# EAGLE schematic pm2019 (EAGLE 9.4.0)

## Sheet 1 of 2
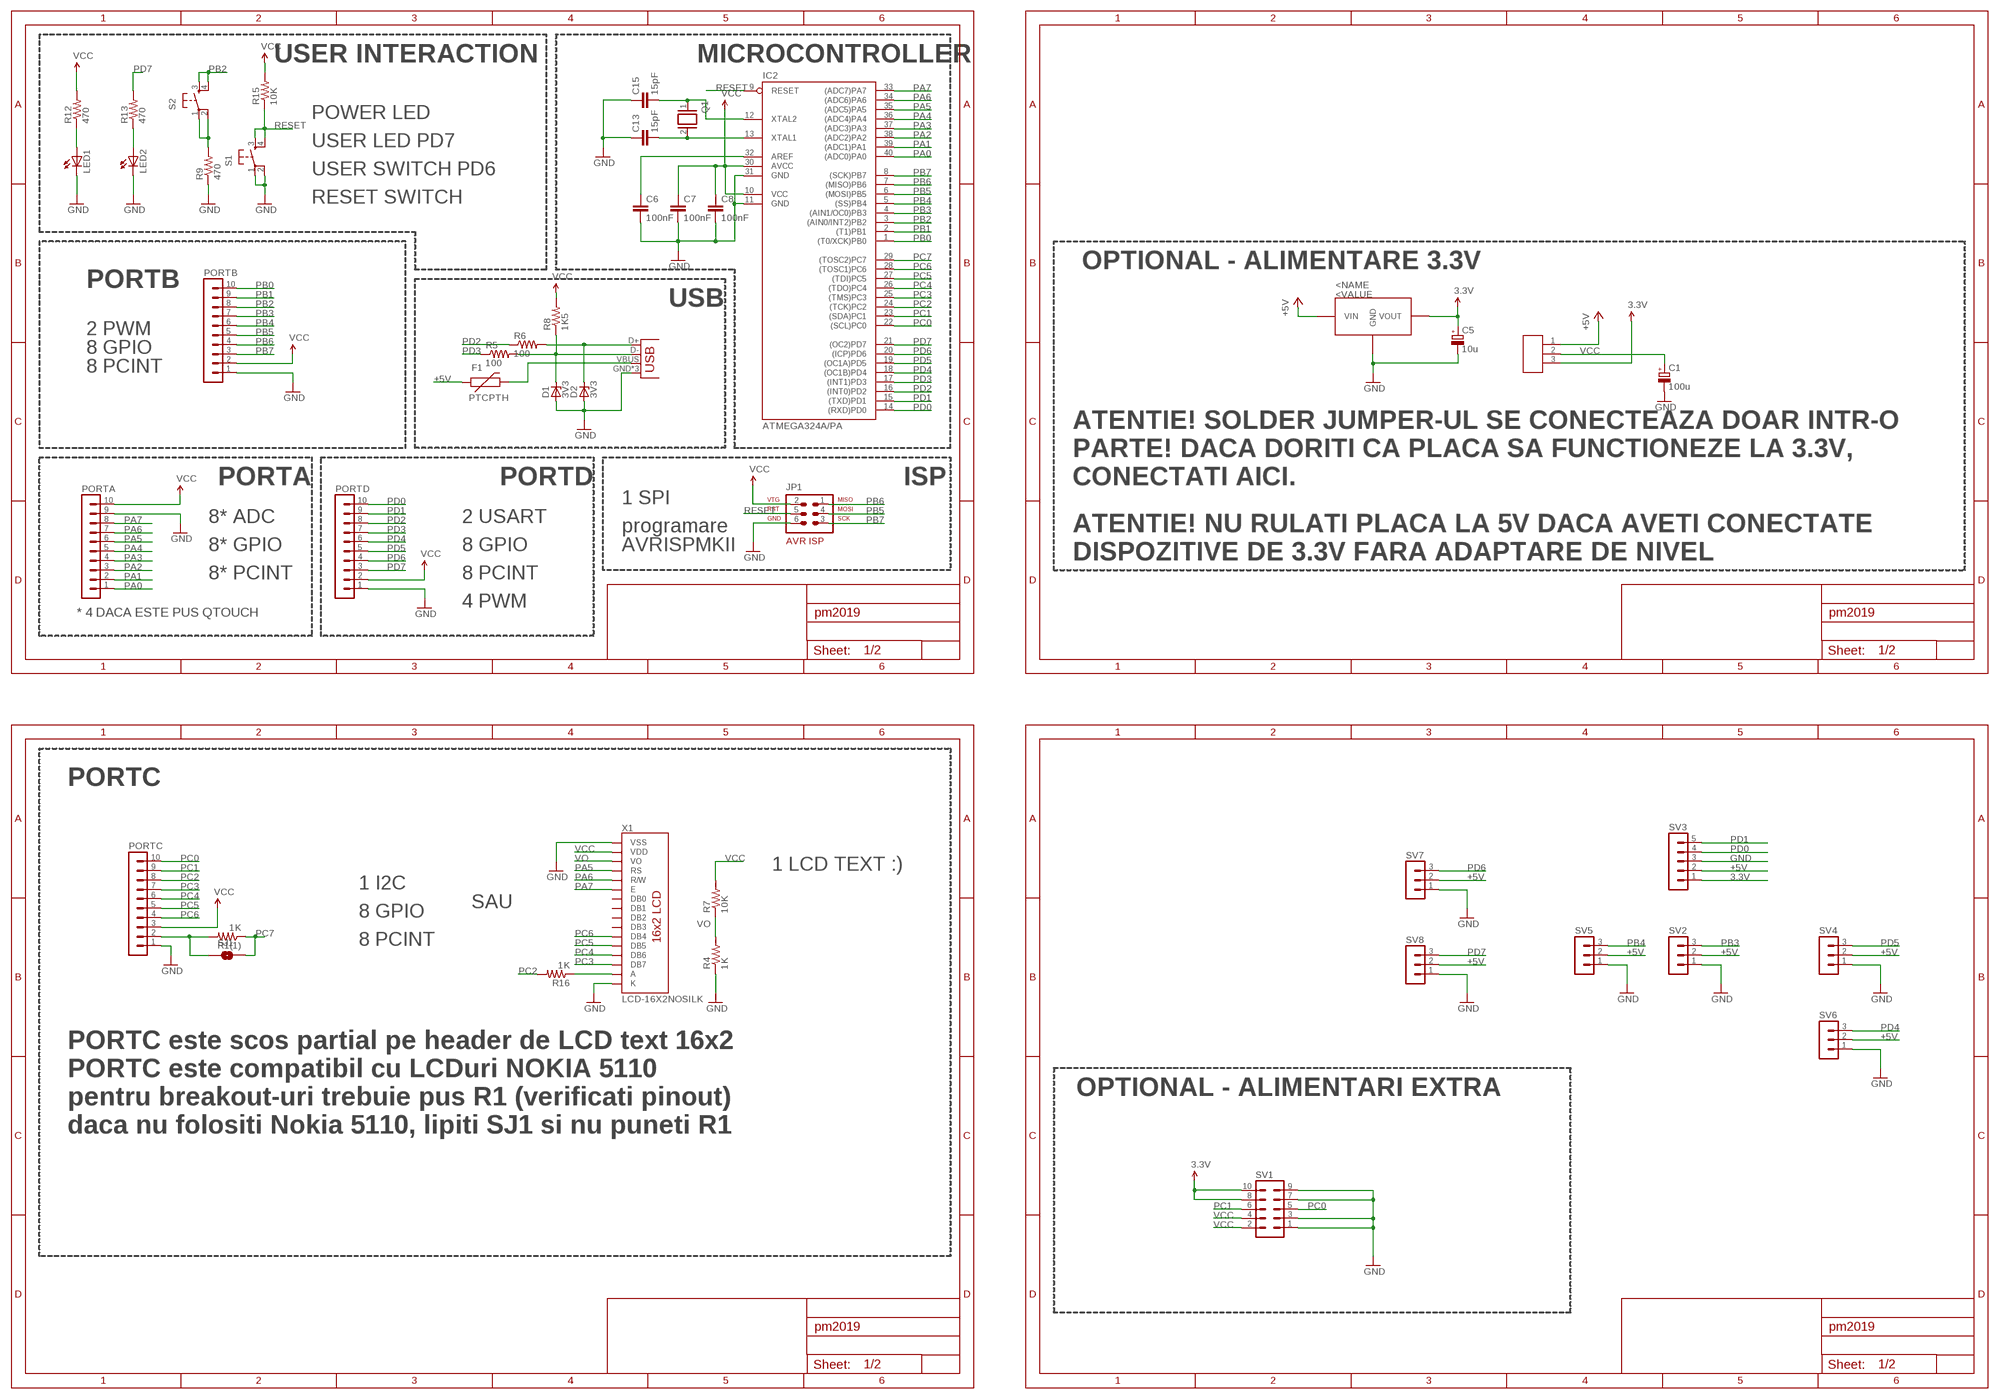
[diagram p0: schematic, sheet 1]

### Parts
C1  100u  CPOL-EUE2.5-5  [E2,5-5]
C5  10u  CPOL-EUE2.5-5  [E2,5-5]
C6  100nF  C-EUC_PM  [C025-025X050]
C7  100nF  C-EUC_PM  [C025-025X050]
C8  100nF  C-EUC_PM  [C025-025X050]
C13  15pF  C-EUC_PM  [C025-025X050]
C15  15pF  C-EUC_PM  [C025-025X050]
D1  3V3  ZENER-DIODEDO34-7  [DO34Z7]
D2  3V3  ZENER-DIODEDO34-7  [DO34Z7]
F1  PTCPTH  [PTC]
IC1  LE33  [TO92]
IC2  ATMEGA324A/PA  MEGA16-P  [DIL40]
J2  USBPTH  [USB-B-PTH]
JP1  AVR-ISP-6  [AVR-ISP-6]
JP2  SJUMPER  [SJUMPER_PACK]
LED1  LED5MM  [LED5MM]
LED2  LED5MM  [LED5MM]
PORTA  MA10-1  [MA10-1]
PORTB  MA10-1  [MA10-1]
PORTC  MA10-1  [MA10-1]
PORTD  MA10-1  [MA10-1]
Q1  XTAL/S  [QS]
R1(1)  1K  RESISTORAXIAL-0.3  [AXIAL-0.3]
R4  1K  RESISTORAXIAL-0.3  [AXIAL-0.3]
R5  100  RESISTORAXIAL-0.3  [AXIAL-0.3]
R6  100  RESISTORAXIAL-0.3  [AXIAL-0.3]
R7  10K  RESISTORAXIAL-0.3  [AXIAL-0.3]
R8  1K5  RESISTORAXIAL-0.3  [AXIAL-0.3]
R9  470  RESISTORAXIAL-0.3  [AXIAL-0.3]
R12  470  RESISTORAXIAL-0.3  [AXIAL-0.3]
R13  470  RESISTORAXIAL-0.3  [AXIAL-0.3]
R15  10K  RESISTORAXIAL-0.3  [AXIAL-0.3]
R16  1K  RESISTORAXIAL-0.3  [AXIAL-0.3]
S1  TAC_SWITCHPTH  [TACTILE-PTH]
S2  TAC_SWITCHPTH  [TACTILE-PTH]
SJ1  SOLDERJUMPERNC  [SJ-NC]
SV1  MA05-2  [MA05-2]
SV2  MA03-1  [MA03-1]
SV3  MA05-1  [MA05-1]
SV4  MA03-1  [MA03-1]
SV5  MA03-1  [MA03-1]
SV6  MA03-1  [MA03-1]
SV7  MA03-1  [MA03-1]
SV8  MA03-1  [MA03-1]
X1  LCD-16X2NOSILK  [LCD-16X2_NOSILK]

### Nets
3.3V: C5.+ IC1.1(VOUT) JP2.3 SV1.8 SV1.10 SV3.1
+5V: F1.P$1 IC1.3(VIN) JP2.1 SV2.2 SV3.2 SV4.2 SV5.2 SV6.2 SV7.2 SV8.2 ; also sheet 2
GND: C1.- C5.- C6.2 C7.2 C8.2 C13.1 C15.1 D1.A D2.A IC1.2(GND) IC2.11(GND) IC2.31(GND) J2.GND J2.P$1(GND) J2.P$2(GND) JP1.6 LED1.K(C) LED2.K(C) PORTA.9 PORTB.1 PORTC.1 PORTD.1 R4.P$1 R9.P$1 S1.1 S1.2 SV1.1 SV1.3 SV1.7 SV1.9 SV2.1 SV3.3 SV4.1 SV5.1 SV6.1 SV7.1 SV8.1 X1.1(VSS) X1.16(K) ; also sheet 2
N$1: LED2.A R13.P$1
N$2: LED1.A R12.P$1
N$3: PORTC.2 R1(1).P$2 SJ1.1
N$4: F1.P$2 J2.VBUS
N$8: R16.P$1 X1.15(A)
N$14: D2.C J2.D+ R6.P$2
N$15: D1.C J2.D- R5.P$2 R8.P$1
N$17: R9.P$2 S2.1 S2.2
N$20: C6.1 IC2.32(AREF)
N$21: C13.2 IC2.13(XTAL1) Q1.2
N$22: C15.2 IC2.12(XTAL2) Q1.1
PA0: IC2.40((ADC0)PA0) PORTA.1 ; also sheet 2
PA1: IC2.39((ADC1)PA1) PORTA.2 ; also sheet 2
PA2: IC2.38((ADC2)PA2) PORTA.3 ; also sheet 2
PA3: IC2.37((ADC3)PA3) PORTA.4 ; also sheet 2
PA4: IC2.36((ADC4)PA4) PORTA.5 ; also sheet 2
PA5: IC2.35((ADC5)PA5) PORTA.6 X1.4(RS) ; also sheet 2
PA6: IC2.34((ADC6)PA6) PORTA.7 X1.5(R/W) ; also sheet 2
PA7: IC2.33((ADC7)PA7) PORTA.8 X1.6(E) ; also sheet 2
PB0: IC2.1((T0/XCK)PB0) PORTB.10 ; also sheet 2
PB1: IC2.2((T1)PB1) PORTB.9 ; also sheet 2
PB2: IC2.3((AIN0/INT2)PB2) PORTB.8 S2.3 S2.4 ; also sheet 2
PB3: IC2.4((AIN1/OC0)PB3) PORTB.7 SV2.3 ; also sheet 2
PB4: IC2.5((SS)PB4) PORTB.6 SV5.3 ; also sheet 2
PB5: IC2.6((MOSI)PB5) JP1.4 PORTB.5 ; also sheet 2
PB6: IC2.7((MISO)PB6) JP1.1 PORTB.4 ; also sheet 2
PB7: IC2.8((SCK)PB7) JP1.3 PORTB.3 ; also sheet 2
PC0: IC2.22((SCL)PC0) PORTC.10 SV1.5 ; also sheet 2
PC1: IC2.23((SDA)PC1) PORTC.9 SV1.6 ; also sheet 2
PC2: IC2.24((TCK)PC2) PORTC.8 R16.P$2 ; also sheet 2
PC3: IC2.25((TMS)PC3) PORTC.7 X1.14(DB7) ; also sheet 2
PC4: IC2.26((TDO)PC4) PORTC.6 X1.13(DB6) ; also sheet 2
PC5: IC2.27((TDI)PC5) PORTC.5 X1.12(DB5) ; also sheet 2
PC6: IC2.28((TOSC1)PC6) PORTC.4 X1.11(DB4) ; also sheet 2
PC7: IC2.29((TOSC2)PC7) R1(1).P$1 SJ1.2 ; also sheet 2
PD0: IC2.14((RXD)PD0) PORTD.10 SV3.4 ; also sheet 2
PD1: IC2.15((TXD)PD1) PORTD.9 SV3.5 ; also sheet 2
PD2: IC2.16((INT0)PD2) PORTD.8 R6.P$1 ; also sheet 2
PD3: IC2.17((INT1)PD3) PORTD.7 R5.P$1 ; also sheet 2
PD4: IC2.18((OC1B)PD4) PORTD.6 SV6.3 ; also sheet 2
PD5: IC2.19((OC1A)PD5) PORTD.5 SV4.3 ; also sheet 2
PD6: IC2.20((ICP)PD6) PORTD.4 SV7.3 ; also sheet 2
PD7: IC2.21((OC2)PD7) PORTD.3 R13.P$2 SV8.3 ; also sheet 2
RESET: IC2.9(RESET) JP1.5 R15.P$1 S1.3 S1.4 ; also sheet 2
VCC: C1.+ C7.1 C8.1 IC2.10(VCC) IC2.30(AVCC) JP1.2 JP2.2 PORTA.10 PORTB.2 PORTC.3 PORTD.2 R7.P$2 R8.P$2 R12.P$2 R15.P$2 SV1.2 SV1.4 X1.2(VDD) ; also sheet 2
VO: R4.P$2 R7.P$1 X1.3(VO)
Unconnected: X1.7(DB0) X1.8(DB1) X1.9(DB2) X1.10(DB3)

### Notes on the sheet
- USER INTERACTION | MICROCONTROLLER
- POWER LED
- USER LED PD7
- USER SWITCH PD6
- RESET SWITCH
- OPTIONAL - ALIMENTARE 3.3V
- PORTB
- USB
- 2 PWM
- 8 GPIO
- 8 PCINT
- ATENTIE! SOLDER JUMPER-UL SE CONECTEAZA DOAR INTR-O
- PARTE! DACA DORITI CA PLACA SA FUNCTIONEZE LA 3.3V,
- PORTA | PORTD | ISP | CONECTATI AICI.
- 1 SPI
- 8* ADC | 2 USART
- programare | ATENTIE! NU RULATI PLACA LA 5V DACA AVETI CONECTATE
- 8* GPIO | 8 GPIO | AVRISPMKII
- DISPOZITIVE DE 3.3V FARA ADAPTARE DE NIVEL
- 8* PCINT | 8 PCINT
- 4 PWM
- * 4 DACA ESTE PUS QTOUCH
- PORTC
- 1 LCD TEXT :)
- 1 I2C
- SAU
- 8 GPIO
- 8 PCINT
- PORTC este scos partial pe header de LCD text 16x2
- PORTC este compatibil cu LCDuri NOKIA 5110
- OPTIONAL - ALIMENTARI EXTRA
- pentru breakout-uri trebuie pus R1 (verificati pinout)
- daca nu folositi Nokia 5110, lipiti SJ1 si nu puneti R1

## Sheet 2 of 2
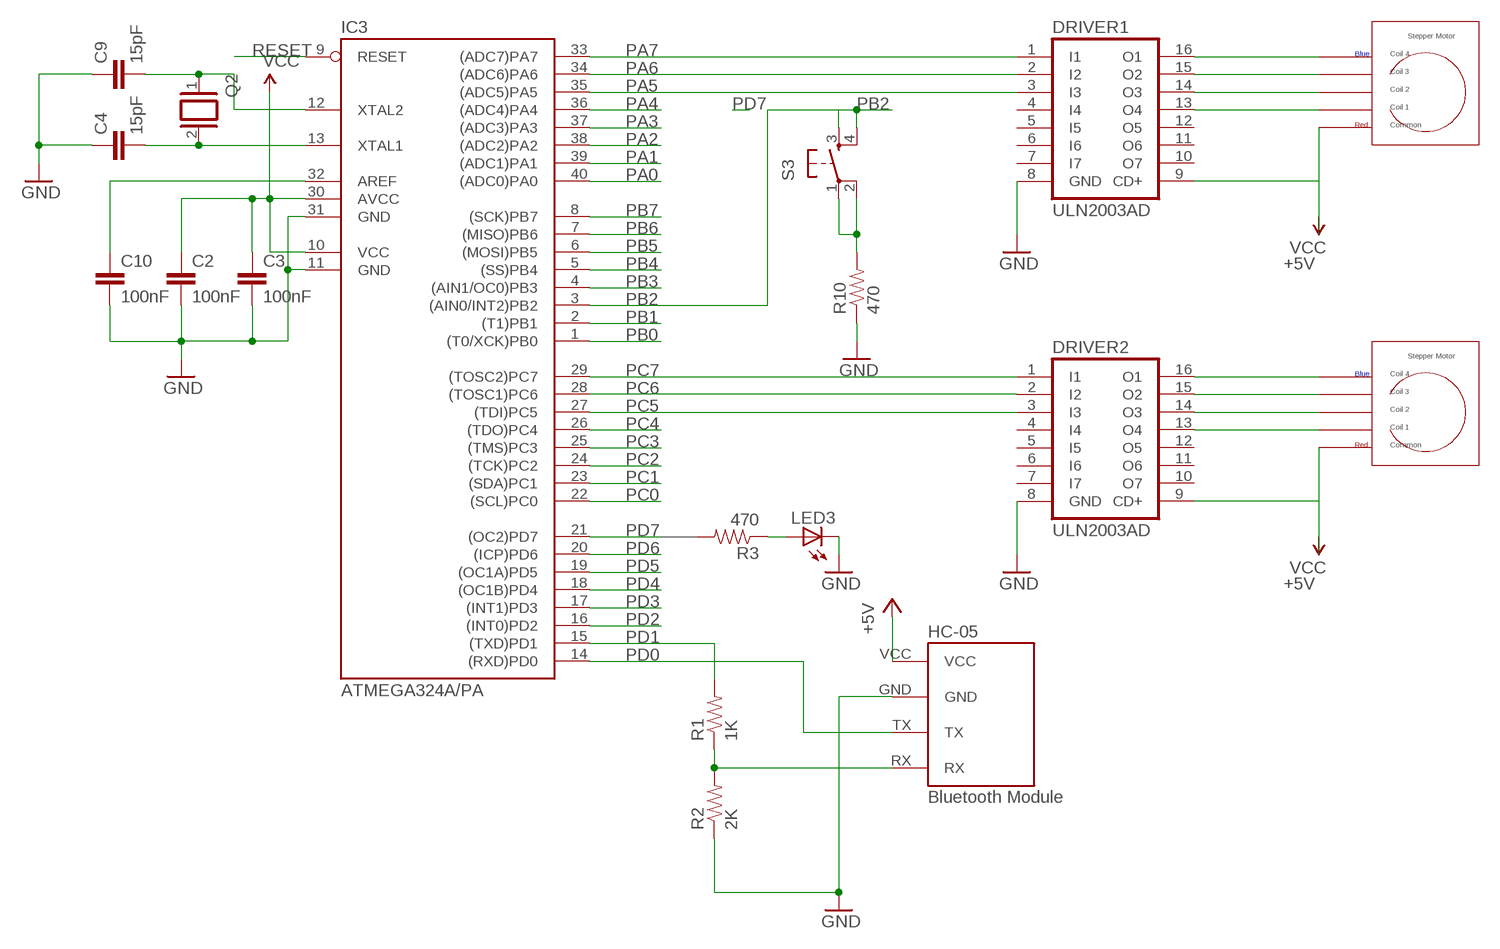
[diagram p1: schematic, sheet 2]

### Parts
C2  100nF  C-EUC_PM  [C025-025X050]
C3  100nF  C-EUC_PM  [C025-025X050]
C4  15pF  C-EUC_PM  [C025-025X050]
C9  15pF  C-EUC_PM  [C025-025X050]
C10  100nF  C-EUC_PM  [C025-025X050]
DRIVER1  ULN2003AD  [SO16]
DRIVER2  ULN2003AD  [SO16]
HC-05  Bluetooth Module  BLUETOOTH_BOARD  [BT_BOARD_FOOTPRINT]
IC3  ATMEGA324A/PA  MEGA16-P  [DIL40]
LED3  LED5MM  [LED5MM]
Q2  XTAL/S  [QS]
R1  1K  RESISTORAXIAL-0.3  [AXIAL-0.3]
R2  2K  RESISTORAXIAL-0.3  [AXIAL-0.3]
R3  470  RESISTORAXIAL-0.3  [AXIAL-0.3]
R10  470  RESISTORAXIAL-0.3  [AXIAL-0.3]
S3  TAC_SWITCHPTH  [TACTILE-PTH]

### Nets
+5V: HC-05.VCC ; also sheet 1
GND: C2.2 C3.2 C4.1 C9.1 C10.2 DRIVER1.8(GND) DRIVER2.8(GND) HC-05.GND IC3.11(GND) IC3.31(GND) LED3.K(C) R2.P$1 R10.P$1 ; also sheet 1
N$5: HC-05.RX R1.P$1 R2.P$2
N$6: DRIVER1.16(O1)
N$7: C10.1 IC3.32(AREF)
N$9: C4.2 IC3.13(XTAL1) Q2.2
N$10: C9.2 IC3.12(XTAL2) Q2.1
N$11: DRIVER1.15(O2)
N$12: DRIVER1.14(O3)
N$13: DRIVER1.13(O4)
N$16: DRIVER2.16(O1)
N$18: DRIVER2.15(O2)
N$19: DRIVER2.14(O3)
N$23: DRIVER2.13(O4)
N$24: LED3.A R3.P$1
N$25: R10.P$2 S3.1 S3.2
PA0: IC3.40((ADC0)PA0) ; also sheet 1
PA1: IC3.39((ADC1)PA1) ; also sheet 1
PA2: IC3.38((ADC2)PA2) ; also sheet 1
PA3: IC3.37((ADC3)PA3) ; also sheet 1
PA4: IC3.36((ADC4)PA4) ; also sheet 1
PA5: DRIVER1.3(I3) IC3.35((ADC5)PA5) ; also sheet 1
PA6: DRIVER1.2(I2) IC3.34((ADC6)PA6) ; also sheet 1
PA7: DRIVER1.1(I1) IC3.33((ADC7)PA7) ; also sheet 1
PB0: IC3.1((T0/XCK)PB0) ; also sheet 1
PB1: IC3.2((T1)PB1) ; also sheet 1
PB2: IC3.3((AIN0/INT2)PB2) S3.3 S3.4 ; also sheet 1
PB3: IC3.4((AIN1/OC0)PB3) ; also sheet 1
PB4: IC3.5((SS)PB4) ; also sheet 1
PB5: IC3.6((MOSI)PB5) ; also sheet 1
PB6: IC3.7((MISO)PB6) ; also sheet 1
PB7: IC3.8((SCK)PB7) ; also sheet 1
PC0: IC3.22((SCL)PC0) ; also sheet 1
PC1: IC3.23((SDA)PC1) ; also sheet 1
PC2: IC3.24((TCK)PC2) ; also sheet 1
PC3: IC3.25((TMS)PC3) ; also sheet 1
PC4: IC3.26((TDO)PC4) ; also sheet 1
PC5: DRIVER2.3(I3) IC3.27((TDI)PC5) ; also sheet 1
PC6: DRIVER2.2(I2) IC3.28((TOSC1)PC6) ; also sheet 1
PC7: DRIVER2.1(I1) IC3.29((TOSC2)PC7) ; also sheet 1
PD0: HC-05.TX IC3.14((RXD)PD0) ; also sheet 1
PD1: IC3.15((TXD)PD1) R1.P$2 ; also sheet 1
PD2: IC3.16((INT0)PD2) ; also sheet 1
PD3: IC3.17((INT1)PD3) ; also sheet 1
PD4: IC3.18((OC1B)PD4) ; also sheet 1
PD5: IC3.19((OC1A)PD5) ; also sheet 1
PD6: IC3.20((ICP)PD6) ; also sheet 1
PD7: IC3.21((OC2)PD7) ; also sheet 1
RESET: IC3.9(RESET) ; also sheet 1
VCC: C2.1 C3.1 DRIVER1.9(CD+) DRIVER2.9(CD+) IC3.10(VCC) IC3.30(AVCC) ; also sheet 1
Unconnected: DRIVER1.4(I4) DRIVER1.5(I5) DRIVER1.6(I6) DRIVER1.7(I7) DRIVER1.10(O7) DRIVER1.11(O6) DRIVER1.12(O5) DRIVER2.4(I4) DRIVER2.5(I5) DRIVER2.6(I6) DRIVER2.7(I7) DRIVER2.10(O7) DRIVER2.11(O6) DRIVER2.12(O5) R3.P$2

### Notes on the sheet
- Stepper Motor
- Blue | Coil 4
- Coil 3
- Coil 2
- Coil 1
- Red | Common
- +5V
- Stepper Motor
- Blue | Coil 4
- Coil 3
- Coil 2
- Coil 1
- Red | Common
- +5V

## Library data of the parts
C1 C5 = resistor:CPOL-EU: POLARIZED CAPACITOR, European symbol
C2-C4 C6-C10 C13 C15 = 0andrei_custom:C-EU: CAPACITOR, European symbol
D1 D2 = diode:ZENER-DIODE: Z-Diode
DRIVER1 DRIVER2 = uln-udn:ULN2003A: DRIVER ARRAY
F1 = SparkFun:PTC: Resettable Fuse PTC Resettable Fuse. Spark Fun Electronics SKU : COM-08357
HC-05 = hc-05:BLUETOOTH_BOARD: Bluetooth Board V1.05
IC1 = 0andrei_custom:LE33
IC2 IC3 = atmel:MEGA16-P: MICROCONTROLLER 16 Kbytes FLASH 1 kbytes SRAM 512 bytes EEPROM USART 8-channel 10 bit ADC Source: avr.lbr; MPN: ATMEGA16-16PU; OC_FARNELL: 9171142; OC_NEWARK: 01M6885
J2 = 0andrei_custom:USB: USB Connectors USB-B-PTH is fully proven SKU : PRT-00139 USB-miniB is fully proven SKU : PRT-00587 USB-A-PCB is untested. USB-A-H is throughly reviewed, but untested. Spark Fun Electronics SKU : PRT-00437 USB-B-SMT is throughly reviewed, but untested. Needs silkscreen touching up. USB-A-S has not been used/tested USB-MB-H has not been used/tested
JP1 = 0andrei_custom:AVR-ISP-6: AVR ISP-6 Serial Programming Header
JP2 = 0andrei_custom:SJUMPER
LED1-LED3 = led:LED: LED OSRAM: - CHIPLED LG R971, LG N971, LY N971, LG Q971, LY Q971, LO R971, LY R971 LH N974, LH R974 LS Q976, LO Q976, LY Q976 LO Q996 - Hyper CHIPLED LW Q18S LB Q993, LB Q99A, LB R99A - SideLED LS A670, LO A670, LY A670, LG A670, LP A670 LB A673, LV A673, LT A673, LW A673 LH A674 LY A675 LS A676, LA A676, LO A676, LY A676, LW A676 LS A679, LY A679, LG A679 - Hyper Micro SIDELED® LS Y876, LA Y876, LO Y876, LY Y876 LT Y87S - SmartLED LW L88C, LW L88S LB L89C, LB L89S, LG L890 LS L89K, LO L89K, LY L89K LS L896, LA L896, LO L896, LY L896 - TOPLED LS T670, LO T670, LY T670, LG T670, LP T670 LSG T670, LSP T670, LSY T670, LOP T670, LYG T670 LG T671, LOG T671, LSG T671 LB T673, LV T673, LT T673, LW T673 LH T674 LS T676, LA T676, LO T676, LY T676, LB T676, LH T676, LSB T676, LW T676 LB T67C, LV T67C, LT T67C, LS T67K, LO T67K, LY T67K, LW E67C LS E67B, LA E67B, LO E67B, LY E67B, LB E67C, LV E67C, LT E67C LW T67C LS T679, LY T679, LG T679 LS T770, LO T770, LY T770, LG T770, LP T770 LB T773, LV T773, LT T773, LW T773 LH T774 LS E675, LA E675, LY E675, LS T675 LS T776, LA T776, LO T776, LY T776, LB T776 LHGB T686 LT T68C, LB T68C - Hyper Mini TOPLED® LB M676 - Mini TOPLED Santana® LG M470 LS M47K, LO M47K, LY M47K Source: http://www.osram.convergy.de LUXEON: - LUMILED® LXK2-PW12-R00, LXK2-PW12-S00, LXK2-PW14-U00, LXK2-PW14-V00 LXK2-PM12-R00, LXK2-PM12-S00, LXK2-PM14-U00 LXK2-PE12-Q00, LXK2-PE12-R00, LXK2-PE12-S00, LXK2-PE14-T00, LXK2-PE14-U00 LXK2-PB12-K00, LXK2-PB12-L00, LXK2-PB12-M00, LXK2-PB14-N00, LXK2-PB14-P00, LXK2-PB14-Q00 LXK2-PR12-L00, LXK2-PR12-M00, LXK2-PR14-Q00, LXK2-PR14-R00 LXK2-PD12-Q00, LXK2-PD12-R00, LXK2-PD12-S00 LXK2-PH12-R00, LXK2-PH12-S00 LXK2-PL12-P00, LXK2-PL12-Q00, LXK2-PL12-R00 Source: www.luxeon.com KINGBRIGHT: KA-3528ASYC Source: www.kingbright.com
PORTA PORTB PORTC PORTD = con-lstb:MA10-1: PIN HEADER; OC_FARNELL: unknown; OC_NEWARK: unknown
Q1 Q2 = special:XTAL/S: CRYSTAL
R1 R1(1) R2-R10 R12 R13 R15 R16 = SparkFun-Passives:RESISTOR: Resistor Basic schematic elements and footprints for 0603, 1206, and PTH resistors.
S1-S3 = SparkFun:TAC_SWITCH: Momentary Switch Button commonly used for reset or general input. Spark Fun Electronics SKU : COM-00097
SJ1 = SparkFun-3-2-07:SOLDERJUMPER: Solder Jumper Standard SMD solder jumper. Used to automate production. Two varients : Normally Open and Normally Closed are the same, but have different paste layers. NC will have a large amount of paste and should jumper during reflow.
SV1 = con-lstb:MA05-2: PIN HEADER; OC_FARNELL: unknown; OC_NEWARK: unknown
SV2 SV4-SV8 = con-lstb:MA03-1: PIN HEADER; OC_FARNELL: unknown; OC_NEWARK: unknown
SV3 = con-lstb:MA05-1: PIN HEADER; OC_FARNELL: unknown; OC_NEWARK: unknown
X1 = 0andrei_custom:LCD-16X2: Standard text-only 16x2 parallel input LCD

## Net classes
1 power: width 0.61 mm